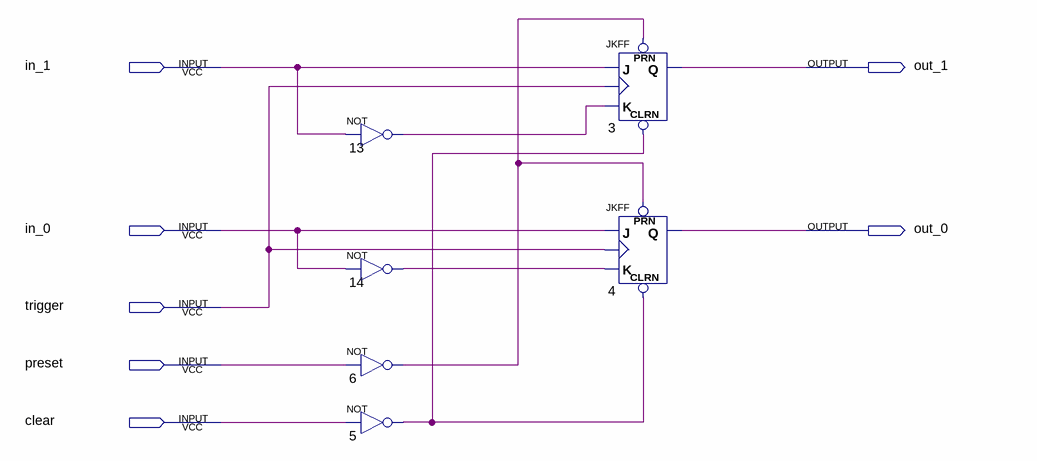
[diagram p0: schematic sheet]
// Quartus schematic registrador.bdf as structural Verilog: 6 symbols, 7 pins
module registrador (
  input  in_1,
  input  in_0,
  input  trigger,
  input  preset,
  input  clear,
  output out_1,
  output out_0
);

  wire n5_out, n6_out, n13_out, n14_out;

  not u_13 (n13_out, in_1);
  not u_14 (n14_out, in_0);
  not u_6 (n6_out, preset);
  not u_5 (n5_out, clear);
  JKFF u_3 (.PRN(n6_out), .CLRN(n5_out), .K(n13_out), .J(in_1), .CLK(trigger), .Q(out_1));
  JKFF u_4 (.PRN(n6_out), .CLRN(n5_out), .K(n14_out), .J(in_0), .CLK(trigger), .Q(out_0));
endmodule
